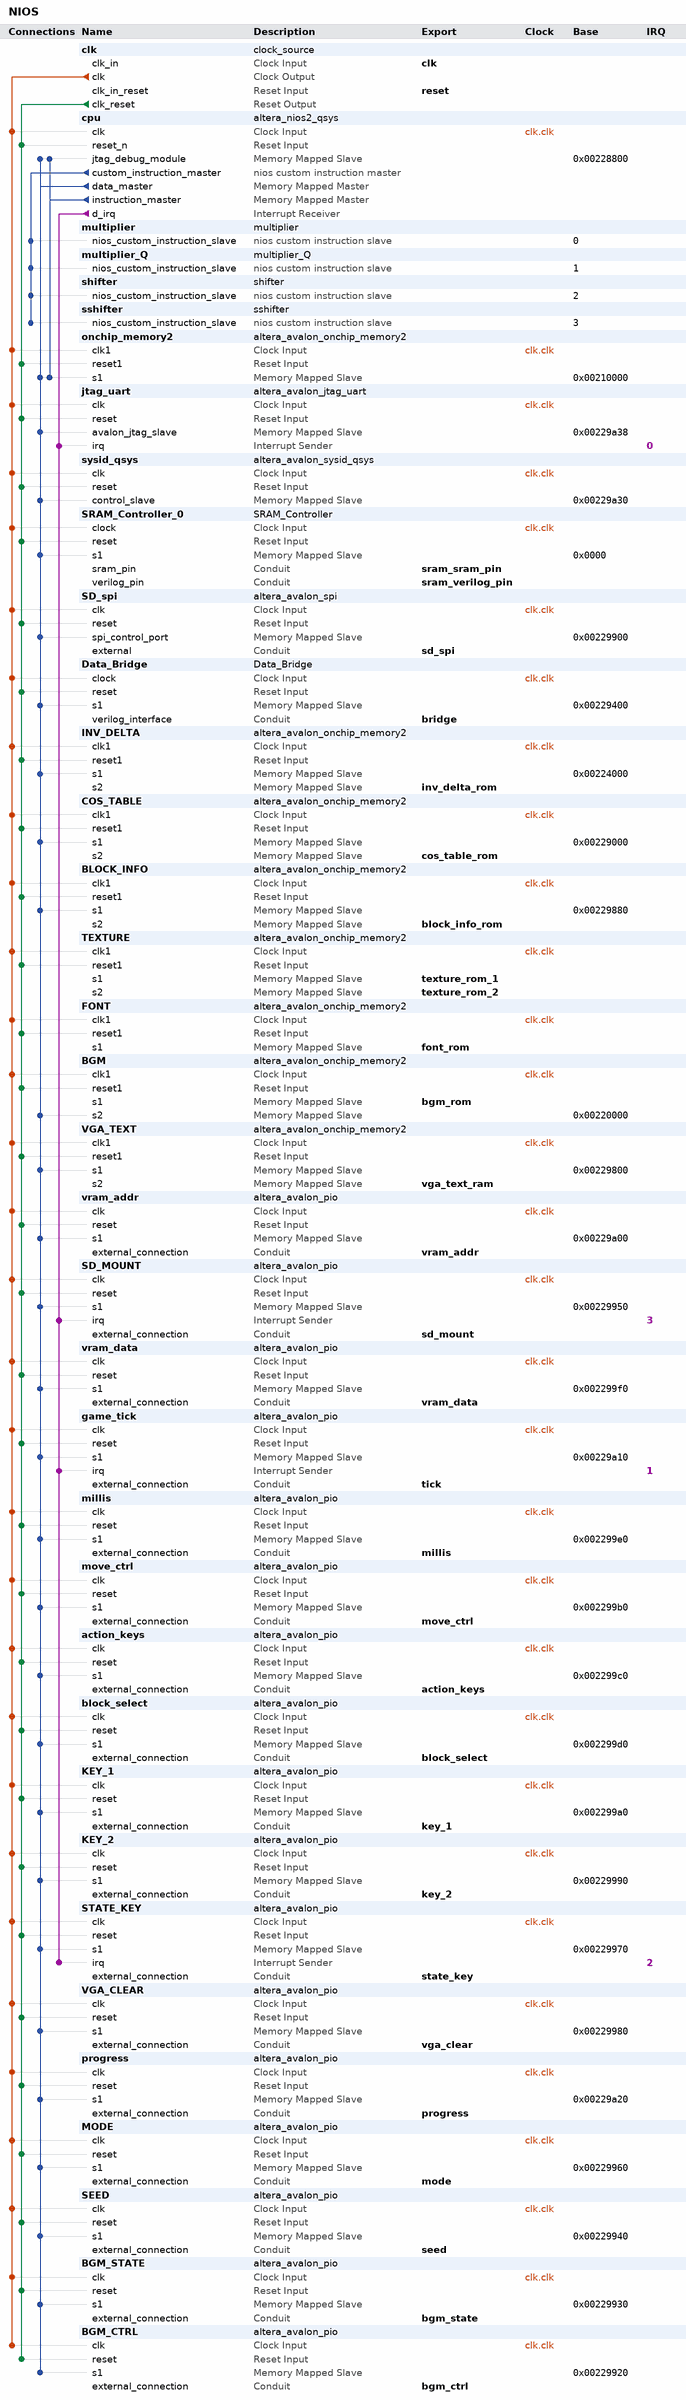
[diagram p0: system contents]
# Platform Designer (Qsys) system NIOS, Cyclone IV E EP4CE115F29C7
# Parameters at their usual value, and those the tool derives, are not listed.
package require -exact qsys 13.1
create_system NIOS
set_project_property DEVICE_FAMILY {Cyclone IV E}
set_project_property DEVICE EP4CE115F29C7

add_instance clk clock_source 13.1
set_instance_parameter_value clk clockFrequency 100000000

add_instance cpu altera_nios2_qsys 13.1
set_instance_parameter_value cpu resetSlave onchip_memory2.s1
set_instance_parameter_value cpu mmu_TLBMissExcSlave None
set_instance_parameter_value cpu exceptionSlave onchip_memory2.s1
set_instance_parameter_value cpu breakSlave cpu.jtag_debug_module
set_instance_parameter_value cpu impl Tiny
set_instance_parameter_value cpu icache_size 4096

add_instance multiplier multiplier 1.0

add_instance multiplier_Q multiplier_Q 1.0

add_instance shifter shifter 1.0

add_instance sshifter sshifter 1.0

add_instance onchip_memory2 altera_avalon_onchip_memory2 13.1
set_instance_parameter_value onchip_memory2 dataWidth 32
set_instance_parameter_value onchip_memory2 dualPort false
set_instance_parameter_value onchip_memory2 initMemContent true
set_instance_parameter_value onchip_memory2 initializationFileName software/mem_init/NIOS_onchip_memory2.hex
set_instance_parameter_value onchip_memory2 memorySize 65536
set_instance_parameter_value onchip_memory2 useNonDefaultInitFile true

add_instance jtag_uart altera_avalon_jtag_uart 13.1
set_instance_parameter_value jtag_uart simInteractiveOptions NO_INTERACTIVE_WINDOWS

add_instance sysid_qsys altera_avalon_sysid_qsys 13.1
set_instance_parameter_value sysid_qsys id 4660

add_instance SRAM_Controller_0 SRAM_Controller 1.0

add_instance SD_spi altera_avalon_spi 13.1
set_instance_parameter_value SD_spi clockPolarity 0
set_instance_parameter_value SD_spi dataWidth 8
set_instance_parameter_value SD_spi masterSPI true
set_instance_parameter_value SD_spi numberOfSlaves 1
set_instance_parameter_value SD_spi targetClockRate 20000000

add_instance Data_Bridge Data_Bridge 1.0

add_instance INV_DELTA altera_avalon_onchip_memory2 13.1
set_instance_parameter_value INV_DELTA dataWidth 32
set_instance_parameter_value INV_DELTA dualPort true
set_instance_parameter_value INV_DELTA initMemContent true
set_instance_parameter_value INV_DELTA initializationFileName ROM/INV_DELTA.hex
set_instance_parameter_value INV_DELTA memorySize 16384
set_instance_parameter_value INV_DELTA singleClockOperation true
set_instance_parameter_value INV_DELTA useNonDefaultInitFile true
set_instance_parameter_value INV_DELTA writable false

add_instance COS_TABLE altera_avalon_onchip_memory2 13.1
set_instance_parameter_value COS_TABLE dataWidth 16
set_instance_parameter_value COS_TABLE dualPort true
set_instance_parameter_value COS_TABLE initMemContent true
set_instance_parameter_value COS_TABLE initializationFileName ROM/COS_TABLE.hex
set_instance_parameter_value COS_TABLE memorySize 1024
set_instance_parameter_value COS_TABLE singleClockOperation true
set_instance_parameter_value COS_TABLE useNonDefaultInitFile true
set_instance_parameter_value COS_TABLE writable false

add_instance BLOCK_INFO altera_avalon_onchip_memory2 13.1
set_instance_parameter_value BLOCK_INFO dataWidth 8
set_instance_parameter_value BLOCK_INFO dualPort true
set_instance_parameter_value BLOCK_INFO initMemContent true
set_instance_parameter_value BLOCK_INFO initializationFileName ROM/BLOCK_INFO.hex
set_instance_parameter_value BLOCK_INFO memorySize 128
set_instance_parameter_value BLOCK_INFO singleClockOperation true
set_instance_parameter_value BLOCK_INFO useNonDefaultInitFile true
set_instance_parameter_value BLOCK_INFO writable false

add_instance TEXTURE altera_avalon_onchip_memory2 13.1
set_instance_parameter_value TEXTURE dataWidth 8
set_instance_parameter_value TEXTURE dualPort true
set_instance_parameter_value TEXTURE initMemContent true
set_instance_parameter_value TEXTURE initializationFileName ROM/TEXTURE.hex
set_instance_parameter_value TEXTURE memorySize 256
set_instance_parameter_value TEXTURE singleClockOperation true
set_instance_parameter_value TEXTURE useNonDefaultInitFile true
set_instance_parameter_value TEXTURE writable false

add_instance FONT altera_avalon_onchip_memory2 13.1
set_instance_parameter_value FONT dataWidth 64
set_instance_parameter_value FONT dualPort false
set_instance_parameter_value FONT initMemContent true
set_instance_parameter_value FONT initializationFileName ROM/FONT.hex
set_instance_parameter_value FONT memorySize 1024
set_instance_parameter_value FONT useNonDefaultInitFile true
set_instance_parameter_value FONT writable false

add_instance BGM altera_avalon_onchip_memory2 13.1
set_instance_parameter_value BGM dataWidth 64
set_instance_parameter_value BGM dualPort true
set_instance_parameter_value BGM initMemContent true
set_instance_parameter_value BGM initializationFileName ROM/BGM.hex
set_instance_parameter_value BGM memorySize 16384
set_instance_parameter_value BGM singleClockOperation true
set_instance_parameter_value BGM useNonDefaultInitFile true

add_instance VGA_TEXT altera_avalon_onchip_memory2 13.1
set_instance_parameter_value VGA_TEXT dataWidth 8
set_instance_parameter_value VGA_TEXT dualPort true
set_instance_parameter_value VGA_TEXT initMemContent true
set_instance_parameter_value VGA_TEXT initializationFileName onchip_mem.hex
set_instance_parameter_value VGA_TEXT memorySize 128
set_instance_parameter_value VGA_TEXT singleClockOperation true

add_instance vram_addr altera_avalon_pio 13.1
set_instance_parameter_value vram_addr direction Output
set_instance_parameter_value vram_addr width 16

add_instance SD_MOUNT altera_avalon_pio 13.1
set_instance_parameter_value SD_MOUNT captureEdge true
set_instance_parameter_value SD_MOUNT direction Input
set_instance_parameter_value SD_MOUNT generateIRQ true
set_instance_parameter_value SD_MOUNT irqType EDGE
set_instance_parameter_value SD_MOUNT width 1

add_instance vram_data altera_avalon_pio 13.1
set_instance_parameter_value vram_data direction Input
set_instance_parameter_value vram_data width 8

add_instance game_tick altera_avalon_pio 13.1
set_instance_parameter_value game_tick captureEdge true
set_instance_parameter_value game_tick direction Input
set_instance_parameter_value game_tick generateIRQ true
set_instance_parameter_value game_tick irqType EDGE
set_instance_parameter_value game_tick width 1

add_instance millis altera_avalon_pio 13.1
set_instance_parameter_value millis direction Input
set_instance_parameter_value millis width 32

add_instance move_ctrl altera_avalon_pio 13.1
set_instance_parameter_value move_ctrl direction Input
set_instance_parameter_value move_ctrl width 10

add_instance action_keys altera_avalon_pio 13.1
set_instance_parameter_value action_keys direction Input
set_instance_parameter_value action_keys width 2

add_instance block_select altera_avalon_pio 13.1
set_instance_parameter_value block_select direction Input
set_instance_parameter_value block_select width 8

add_instance KEY_1 altera_avalon_pio 13.1
set_instance_parameter_value KEY_1 direction Input
set_instance_parameter_value KEY_1 width 32

add_instance KEY_2 altera_avalon_pio 13.1
set_instance_parameter_value KEY_2 direction Input
set_instance_parameter_value KEY_2 width 32

add_instance STATE_KEY altera_avalon_pio 13.1
set_instance_parameter_value STATE_KEY captureEdge true
set_instance_parameter_value STATE_KEY direction Input
set_instance_parameter_value STATE_KEY generateIRQ true
set_instance_parameter_value STATE_KEY irqType EDGE
set_instance_parameter_value STATE_KEY width 8

add_instance VGA_CLEAR altera_avalon_pio 13.1
set_instance_parameter_value VGA_CLEAR direction Output
set_instance_parameter_value VGA_CLEAR width 9

add_instance progress altera_avalon_pio 13.1
set_instance_parameter_value progress direction Output
set_instance_parameter_value progress width 8

add_instance MODE altera_avalon_pio 13.1
set_instance_parameter_value MODE direction Output
set_instance_parameter_value MODE width 8

add_instance SEED altera_avalon_pio 13.1
set_instance_parameter_value SEED direction Input
set_instance_parameter_value SEED width 32

add_instance BGM_STATE altera_avalon_pio 13.1
set_instance_parameter_value BGM_STATE direction Input
set_instance_parameter_value BGM_STATE width 8

add_instance BGM_CTRL altera_avalon_pio 13.1
set_instance_parameter_value BGM_CTRL direction Output
set_instance_parameter_value BGM_CTRL width 8

# connections
add_connection clk.clk action_keys.clk clock
add_connection clk.clk BGM.clk1 clock
add_connection clk.clk BGM_CTRL.clk clock
add_connection clk.clk BGM_STATE.clk clock
add_connection clk.clk BLOCK_INFO.clk1 clock
add_connection clk.clk block_select.clk clock
add_connection clk.clk COS_TABLE.clk1 clock
add_connection clk.clk cpu.clk clock
add_connection clk.clk Data_Bridge.clock clock
add_connection clk.clk FONT.clk1 clock
add_connection clk.clk game_tick.clk clock
add_connection clk.clk INV_DELTA.clk1 clock
add_connection clk.clk jtag_uart.clk clock
add_connection clk.clk KEY_1.clk clock
add_connection clk.clk KEY_2.clk clock
add_connection clk.clk millis.clk clock
add_connection clk.clk MODE.clk clock
add_connection clk.clk move_ctrl.clk clock
add_connection clk.clk onchip_memory2.clk1 clock
add_connection clk.clk progress.clk clock
add_connection clk.clk SD_MOUNT.clk clock
add_connection clk.clk SD_spi.clk clock
add_connection clk.clk SEED.clk clock
add_connection clk.clk SRAM_Controller_0.clock clock
add_connection clk.clk STATE_KEY.clk clock
add_connection clk.clk sysid_qsys.clk clock
add_connection clk.clk TEXTURE.clk1 clock
add_connection clk.clk VGA_CLEAR.clk clock
add_connection clk.clk VGA_TEXT.clk1 clock
add_connection clk.clk vram_addr.clk clock
add_connection clk.clk vram_data.clk clock
add_connection clk.clk_reset action_keys.reset reset
add_connection clk.clk_reset BGM.reset1 reset
add_connection clk.clk_reset BGM_CTRL.reset reset
add_connection clk.clk_reset BGM_STATE.reset reset
add_connection clk.clk_reset BLOCK_INFO.reset1 reset
add_connection clk.clk_reset block_select.reset reset
add_connection clk.clk_reset COS_TABLE.reset1 reset
add_connection clk.clk_reset cpu.reset_n reset
add_connection clk.clk_reset Data_Bridge.reset reset
add_connection clk.clk_reset FONT.reset1 reset
add_connection clk.clk_reset game_tick.reset reset
add_connection clk.clk_reset INV_DELTA.reset1 reset
add_connection clk.clk_reset jtag_uart.reset reset
add_connection clk.clk_reset KEY_1.reset reset
add_connection clk.clk_reset KEY_2.reset reset
add_connection clk.clk_reset millis.reset reset
add_connection clk.clk_reset MODE.reset reset
add_connection clk.clk_reset move_ctrl.reset reset
add_connection clk.clk_reset onchip_memory2.reset1 reset
add_connection clk.clk_reset progress.reset reset
add_connection clk.clk_reset SD_MOUNT.reset reset
add_connection clk.clk_reset SD_spi.reset reset
add_connection clk.clk_reset SEED.reset reset
add_connection clk.clk_reset SRAM_Controller_0.reset reset
add_connection clk.clk_reset STATE_KEY.reset reset
add_connection clk.clk_reset sysid_qsys.reset reset
add_connection clk.clk_reset TEXTURE.reset1 reset
add_connection clk.clk_reset VGA_CLEAR.reset reset
add_connection clk.clk_reset VGA_TEXT.reset1 reset
add_connection clk.clk_reset vram_addr.reset reset
add_connection clk.clk_reset vram_data.reset reset
add_connection cpu.data_master action_keys.s1 avalon
set_connection_parameter_value cpu.data_master/action_keys.s1 baseAddress 0x002299c0
add_connection cpu.data_master BGM.s2 avalon
set_connection_parameter_value cpu.data_master/BGM.s2 baseAddress 0x00220000
add_connection cpu.data_master BGM_CTRL.s1 avalon
set_connection_parameter_value cpu.data_master/BGM_CTRL.s1 baseAddress 0x00229920
add_connection cpu.data_master BGM_STATE.s1 avalon
set_connection_parameter_value cpu.data_master/BGM_STATE.s1 baseAddress 0x00229930
add_connection cpu.data_master BLOCK_INFO.s1 avalon
set_connection_parameter_value cpu.data_master/BLOCK_INFO.s1 baseAddress 0x00229880
add_connection cpu.data_master block_select.s1 avalon
set_connection_parameter_value cpu.data_master/block_select.s1 baseAddress 0x002299d0
add_connection cpu.data_master COS_TABLE.s1 avalon
set_connection_parameter_value cpu.data_master/COS_TABLE.s1 baseAddress 0x00229000
add_connection cpu.data_master cpu.jtag_debug_module avalon
set_connection_parameter_value cpu.data_master/cpu.jtag_debug_module baseAddress 0x00228800
add_connection cpu.data_master Data_Bridge.s1 avalon
set_connection_parameter_value cpu.data_master/Data_Bridge.s1 baseAddress 0x00229400
add_connection cpu.data_master game_tick.s1 avalon
set_connection_parameter_value cpu.data_master/game_tick.s1 baseAddress 0x00229a10
add_connection cpu.data_master INV_DELTA.s1 avalon
set_connection_parameter_value cpu.data_master/INV_DELTA.s1 baseAddress 0x00224000
add_connection cpu.data_master jtag_uart.avalon_jtag_slave avalon
set_connection_parameter_value cpu.data_master/jtag_uart.avalon_jtag_slave baseAddress 0x00229a38
add_connection cpu.data_master KEY_1.s1 avalon
set_connection_parameter_value cpu.data_master/KEY_1.s1 baseAddress 0x002299a0
add_connection cpu.data_master KEY_2.s1 avalon
set_connection_parameter_value cpu.data_master/KEY_2.s1 baseAddress 0x00229990
add_connection cpu.data_master millis.s1 avalon
set_connection_parameter_value cpu.data_master/millis.s1 baseAddress 0x002299e0
add_connection cpu.data_master MODE.s1 avalon
set_connection_parameter_value cpu.data_master/MODE.s1 baseAddress 0x00229960
add_connection cpu.data_master move_ctrl.s1 avalon
set_connection_parameter_value cpu.data_master/move_ctrl.s1 baseAddress 0x002299b0
add_connection cpu.data_master onchip_memory2.s1 avalon
set_connection_parameter_value cpu.data_master/onchip_memory2.s1 baseAddress 0x00210000
add_connection cpu.data_master progress.s1 avalon
set_connection_parameter_value cpu.data_master/progress.s1 baseAddress 0x00229a20
add_connection cpu.data_master SD_MOUNT.s1 avalon
set_connection_parameter_value cpu.data_master/SD_MOUNT.s1 baseAddress 0x00229950
add_connection cpu.data_master SD_spi.spi_control_port avalon
set_connection_parameter_value cpu.data_master/SD_spi.spi_control_port baseAddress 0x00229900
add_connection cpu.data_master SEED.s1 avalon
set_connection_parameter_value cpu.data_master/SEED.s1 baseAddress 0x00229940
add_connection cpu.data_master SRAM_Controller_0.s1 avalon
set_connection_parameter_value cpu.data_master/SRAM_Controller_0.s1 baseAddress 0x0000
add_connection cpu.data_master STATE_KEY.s1 avalon
set_connection_parameter_value cpu.data_master/STATE_KEY.s1 baseAddress 0x00229970
add_connection cpu.data_master sysid_qsys.control_slave avalon
set_connection_parameter_value cpu.data_master/sysid_qsys.control_slave baseAddress 0x00229a30
add_connection cpu.data_master VGA_CLEAR.s1 avalon
set_connection_parameter_value cpu.data_master/VGA_CLEAR.s1 baseAddress 0x00229980
add_connection cpu.data_master VGA_TEXT.s1 avalon
set_connection_parameter_value cpu.data_master/VGA_TEXT.s1 baseAddress 0x00229800
add_connection cpu.data_master vram_addr.s1 avalon
set_connection_parameter_value cpu.data_master/vram_addr.s1 baseAddress 0x00229a00
add_connection cpu.data_master vram_data.s1 avalon
set_connection_parameter_value cpu.data_master/vram_data.s1 baseAddress 0x002299f0
add_connection cpu.instruction_master cpu.jtag_debug_module avalon
set_connection_parameter_value cpu.instruction_master/cpu.jtag_debug_module baseAddress 0x00228800
add_connection cpu.instruction_master onchip_memory2.s1 avalon
set_connection_parameter_value cpu.instruction_master/onchip_memory2.s1 baseAddress 0x00210000
add_connection cpu.d_irq game_tick.irq interrupt
set_connection_parameter_value cpu.d_irq/game_tick.irq irqNumber 1
add_connection cpu.d_irq jtag_uart.irq interrupt
set_connection_parameter_value cpu.d_irq/jtag_uart.irq irqNumber 0
add_connection cpu.d_irq SD_MOUNT.irq interrupt
set_connection_parameter_value cpu.d_irq/SD_MOUNT.irq irqNumber 3
add_connection cpu.d_irq STATE_KEY.irq interrupt
set_connection_parameter_value cpu.d_irq/STATE_KEY.irq irqNumber 2
add_connection cpu.custom_instruction_master multiplier.nios_custom_instruction_slave nios_custom_instruction
set_connection_parameter_value cpu.custom_instruction_master/multiplier.nios_custom_instruction_slave CIName multiplier
set_connection_parameter_value cpu.custom_instruction_master/multiplier.nios_custom_instruction_slave baseAddress 0
add_connection cpu.custom_instruction_master multiplier_Q.nios_custom_instruction_slave nios_custom_instruction
set_connection_parameter_value cpu.custom_instruction_master/multiplier_Q.nios_custom_instruction_slave CIName multiplier_q
set_connection_parameter_value cpu.custom_instruction_master/multiplier_Q.nios_custom_instruction_slave baseAddress 1
add_connection cpu.custom_instruction_master shifter.nios_custom_instruction_slave nios_custom_instruction
set_connection_parameter_value cpu.custom_instruction_master/shifter.nios_custom_instruction_slave CIName shifter
set_connection_parameter_value cpu.custom_instruction_master/shifter.nios_custom_instruction_slave baseAddress 2
add_connection cpu.custom_instruction_master sshifter.nios_custom_instruction_slave nios_custom_instruction
set_connection_parameter_value cpu.custom_instruction_master/sshifter.nios_custom_instruction_slave CIName sshifter
set_connection_parameter_value cpu.custom_instruction_master/sshifter.nios_custom_instruction_slave baseAddress 3

# exported interfaces
add_interface clk clock sink
set_interface_property clk EXPORT_OF clk.clk_in
add_interface reset reset sink
set_interface_property reset EXPORT_OF clk.clk_in_reset
add_interface sram_sram_pin conduit end
set_interface_property sram_sram_pin EXPORT_OF SRAM_Controller_0.sram_pin
add_interface sram_verilog_pin conduit end
set_interface_property sram_verilog_pin EXPORT_OF SRAM_Controller_0.verilog_pin
add_interface progress conduit end
set_interface_property progress EXPORT_OF progress.external_connection
add_interface tick conduit end
set_interface_property tick EXPORT_OF game_tick.external_connection
add_interface inv_delta_rom avalon slave
set_interface_property inv_delta_rom EXPORT_OF INV_DELTA.s2
add_interface block_info_rom avalon slave
set_interface_property block_info_rom EXPORT_OF BLOCK_INFO.s2
add_interface bridge conduit end
set_interface_property bridge EXPORT_OF Data_Bridge.verilog_interface
add_interface texture_rom_2 avalon slave
set_interface_property texture_rom_2 EXPORT_OF TEXTURE.s2
add_interface vram_addr conduit end
set_interface_property vram_addr EXPORT_OF vram_addr.external_connection
add_interface vram_data conduit end
set_interface_property vram_data EXPORT_OF vram_data.external_connection
add_interface millis conduit end
set_interface_property millis EXPORT_OF millis.external_connection
add_interface sd_spi conduit end
set_interface_property sd_spi EXPORT_OF SD_spi.external
add_interface texture_rom_1 avalon slave
set_interface_property texture_rom_1 EXPORT_OF TEXTURE.s1
add_interface font_rom avalon slave
set_interface_property font_rom EXPORT_OF FONT.s1
add_interface vga_text_ram avalon slave
set_interface_property vga_text_ram EXPORT_OF VGA_TEXT.s2
add_interface block_select conduit end
set_interface_property block_select EXPORT_OF block_select.external_connection
add_interface action_keys conduit end
set_interface_property action_keys EXPORT_OF action_keys.external_connection
add_interface move_ctrl conduit end
set_interface_property move_ctrl EXPORT_OF move_ctrl.external_connection
add_interface key_1 conduit end
set_interface_property key_1 EXPORT_OF KEY_1.external_connection
add_interface key_2 conduit end
set_interface_property key_2 EXPORT_OF KEY_2.external_connection
add_interface vga_clear conduit end
set_interface_property vga_clear EXPORT_OF VGA_CLEAR.external_connection
add_interface state_key conduit end
set_interface_property state_key EXPORT_OF STATE_KEY.external_connection
add_interface mode conduit end
set_interface_property mode EXPORT_OF MODE.external_connection
add_interface cos_table_rom avalon slave
set_interface_property cos_table_rom EXPORT_OF COS_TABLE.s2
add_interface sd_mount conduit end
set_interface_property sd_mount EXPORT_OF SD_MOUNT.external_connection
add_interface seed conduit end
set_interface_property seed EXPORT_OF SEED.external_connection
add_interface bgm_rom avalon slave
set_interface_property bgm_rom EXPORT_OF BGM.s1
add_interface bgm_ctrl conduit end
set_interface_property bgm_ctrl EXPORT_OF BGM_CTRL.external_connection
add_interface bgm_state conduit end
set_interface_property bgm_state EXPORT_OF BGM_STATE.external_connection

set_interconnect_requirement {$system} qsys_mm.clockCrossingAdapter HANDSHAKE
set_interconnect_requirement {$system} qsys_mm.maxAdditionalLatency 1
set_interconnect_requirement {$system} qsys_mm.insertDefaultSlave false

save_system NIOS.qsys
